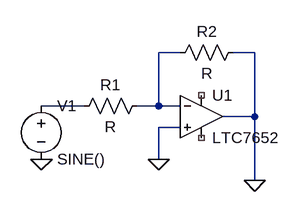
[diagram p0: schematic amplifer.asc]
amplifer.asc, the LTspice schematic file:
Version 4.1
SHEET 1 880 680
WIRE 144 80 112 80
WIRE 256 80 224 80
WIRE 0 160 -64 160
WIRE 112 160 112 80
WIRE 112 160 80 160
WIRE 144 160 112 160
WIRE 256 176 256 80
WIRE 256 176 208 176
WIRE 144 192 112 192
WIRE 112 240 112 192
WIRE 256 272 256 176
FLAG 256 272 0
FLAG 112 240 0
FLAG -64 240 0
SYMBOL OpAmps\\LTC7652 176 112 R0
SYMATTR InstName U1
SYMBOL res 96 144 R90
WINDOW 0 0 56 VBottom 2
WINDOW 3 32 56 VTop 2
SYMATTR InstName R1
SYMBOL res 240 64 R90
WINDOW 0 0 56 VBottom 2
WINDOW 3 32 56 VTop 2
SYMATTR InstName R2
SYMBOL voltage -64 144 R0
WINDOW 123 0 0 Left 0
WINDOW 39 0 0 Left 0
SYMATTR InstName V1
SYMATTR Value SINE()

The netlist it stands for:
* amplifer.asc
X§U1 0 N001 NC_01 NC_02 0 LTC1052  ; LTC7652, pins In+ In- V+ V- OUT
R1 N001 N002 R
R2 0 N001 R
V1 N002 0 SINE()
.backanno
.end